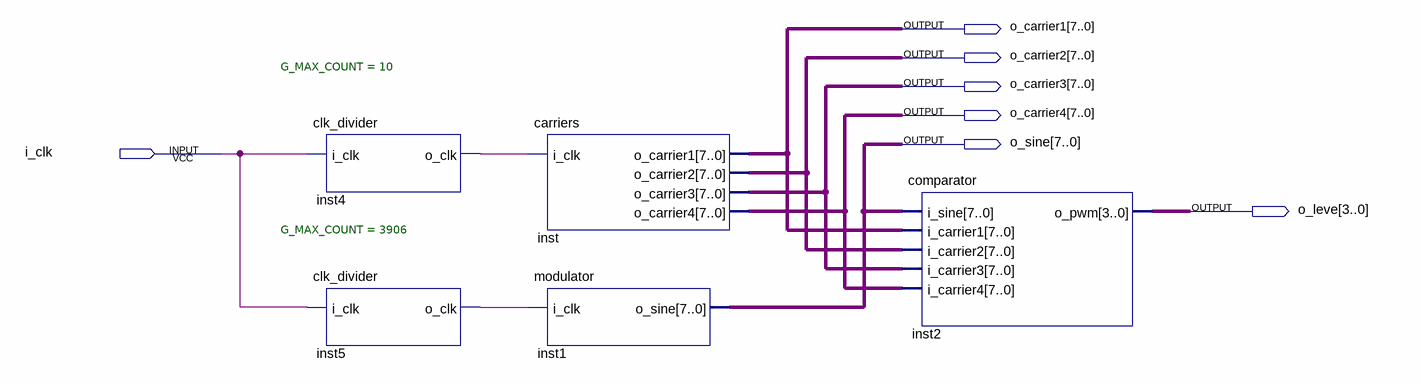
[diagram p0: schematic sheet]
// Quartus schematic apod.bdf as structural Verilog: 5 symbols, 7 pins
module apod (
  input  i_clk,
  output [7:0] o_carrier1,
  output [7:0] o_carrier2,
  output [7:0] o_carrier3,
  output [7:0] o_carrier4,
  output [7:0] o_sine,
  output [3:0] o_leve
);

  wire inst4_o_clk, inst5_o_clk;

  clk_divider #(.G_MAX_COUNT(10)) inst4 (.i_clk(i_clk), .o_clk(inst4_o_clk));
  clk_divider #(.G_MAX_COUNT(3906)) inst5 (.i_clk(i_clk), .o_clk(inst5_o_clk));
  carriers inst (
    .i_clk(inst4_o_clk), .o_carrier1(o_carrier1), .o_carrier2(o_carrier2), .o_carrier3(o_carrier3),
    .o_carrier4(o_carrier4));
  modulator inst1 (.i_clk(inst5_o_clk), .o_sine(o_sine));
  comparator inst2 (
    .i_sine(o_sine), .i_carrier1(o_carrier1), .i_carrier2(o_carrier2), .i_carrier3(o_carrier3),
    .i_carrier4(o_carrier4), .o_pwm(o_leve));
endmodule
